# EAGLE design display (EAGLE 5.10)
2: SPI_D; 3: SPI_CLK; 4: SPI_DC; 5: SPI_CS; 6: GND; 7: 5V; 8: SPI_RES
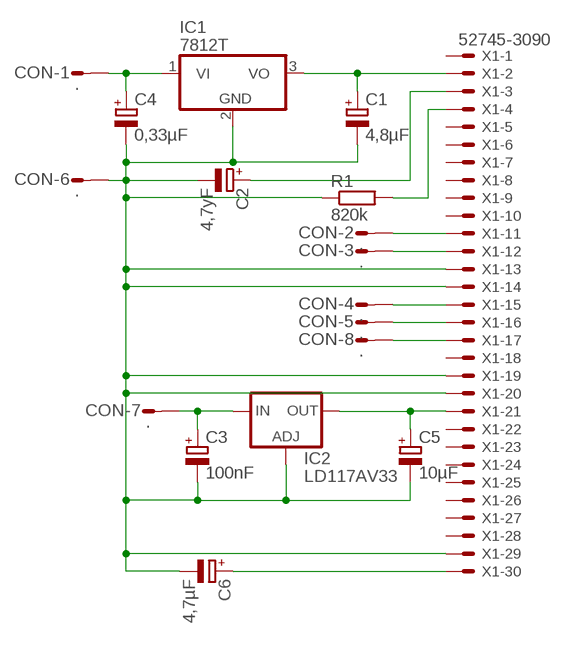
[diagram p0: schematic, sheet 1]

## Parts
C1  4,8µF  CPOL-EUE2-5  [E2-5]
C2  4,7yF  CPOL-EUE2-5  [E2-5]
C3  100nF  CPOL-EUE2-5  [E2-5]
C4  0,33µF  CPOL-EUE2-5  [E2-5]
C5  10µF  CPOL-EUE2-5  [E2-5]
C6  4,7µF  CPOL-EUE2-5  [E2-5]
CON  .  S08P  [S08P]
IC1  7812T  [TO220H]
IC2  LD117AV33  [TO220L1]
R1  820k  R-EU_0207/10  [0207/10]
X1  52745-3090  [52745-3090]

## Nets
N$1: C1.+ IC1.3(VO) X1.2
N$2: C2.+ X1.3
N$3: R1.2 X1.4
N$4: CON.4 X1.15
N$5: CON.5 X1.16
N$6: CON.2 X1.11
N$7: CON.3 X1.12
N$8: C1.- C2.- C3.- C4.- C5.- C6.- CON.6 IC1.2(GND) IC2.1(ADJ) R1.1 X1.13 X1.14 X1.19 X1.20 X1.29
N$9: CON.8 X1.17
N$10: C5.+ IC2.2(OUT) X1.21
N$11: C3.+ CON.7 IC2.3(IN)
N$12: C4.+ CON.1 IC1.1(VI)
N$15: C6.+ X1.30
Unconnected: X1.1 X1.5 X1.6 X1.7 X1.8 X1.9 X1.10 X1.18 X1.22 X1.23 X1.24 X1.25 X1.26 X1.27 X1.28

## Library data of the parts
C1-C6 = resistor:CPOL-EU: POLARIZED CAPACITOR, European symbol
CON = con-amp-mt:S08P: AMP MT CONNECTOR
IC1 = linear:78*: Positive VOLTAGE REGULATOR Source: http://cache.national.com/ds/LM/LM78L05.pdf http://www.fairchildsemi.com/ds/LM/LM7805.pdf
IC2 = v-reg:LD117A?*: Low drop fixed and adjustable positive voltage regulators 1 A Source: http://www.st.com/stonline/products/literature/ds/7194/ld1117axx.pdf
R1 = resistor:R-EU_: RESISTOR, European symbol
X1 = con-molex:52745-3090: FFC/FPC-to-Board 0.50mm (.020") SMT Top Contact Right Angle, ZIF, Style Receptacle 52745 / 52435 Source: http://www.molex.com/product/ffc/52745.html

## Board
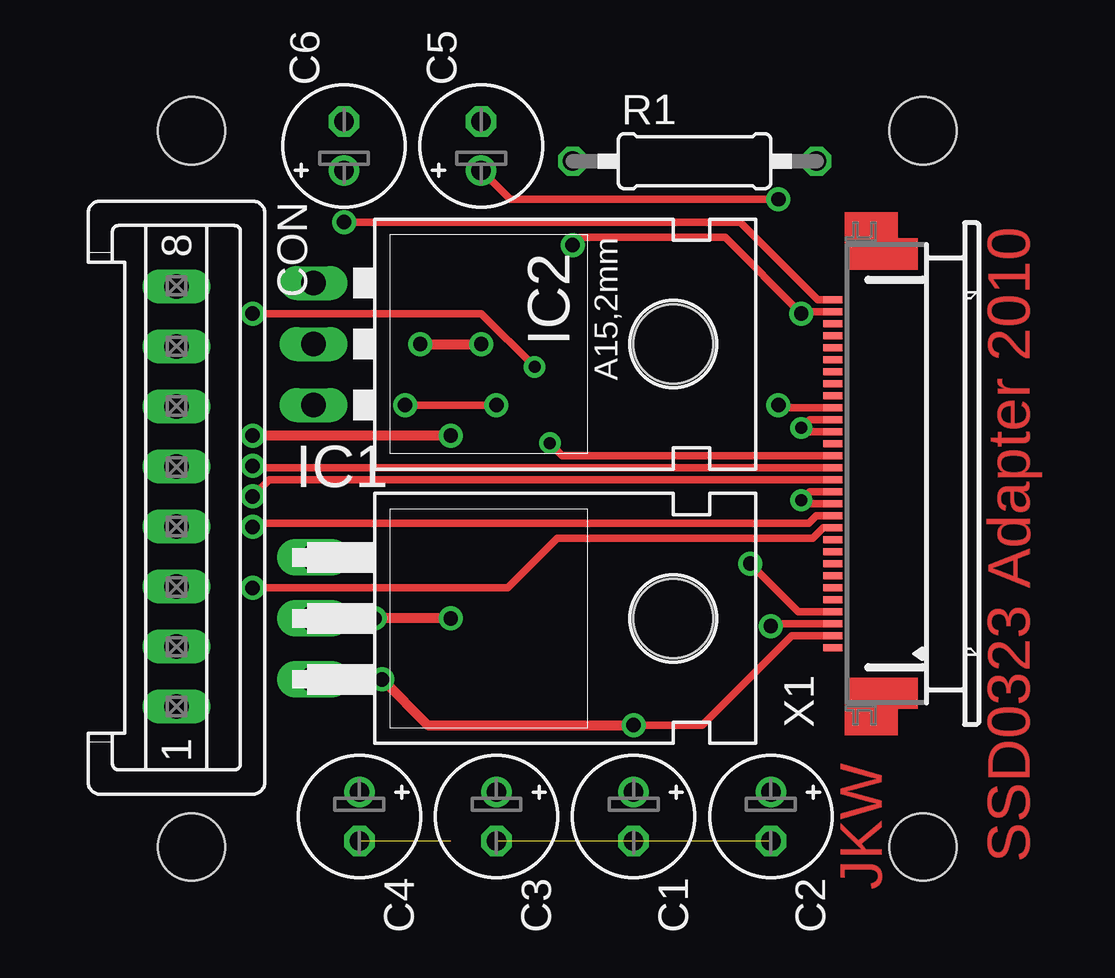
[diagram p1: board, top side]
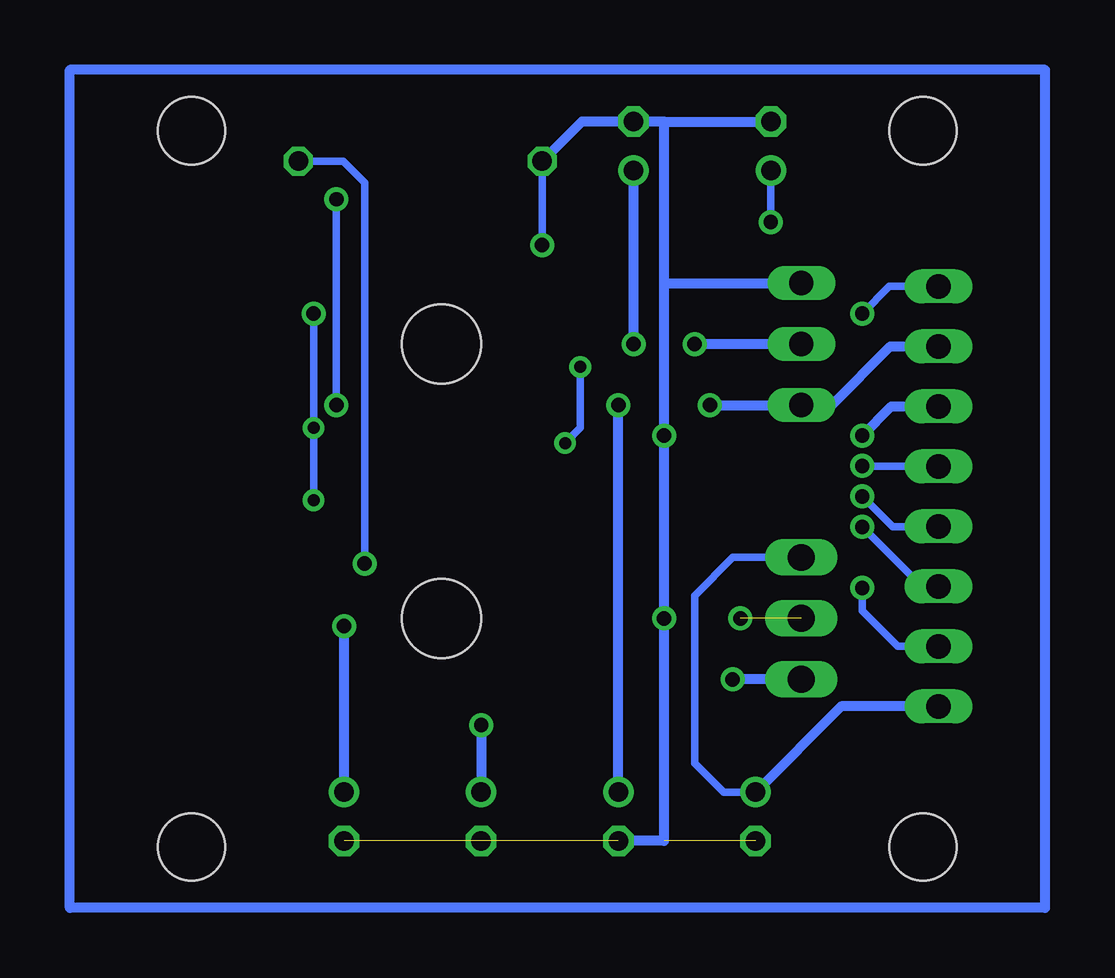
[diagram p2: board, bottom side, seen from below]

No outline drawn. Coordinates in mm, seen from the top.
Copper layers (1*16): Top 0.035mm / dielectric 1.5mm / Bottom 0.035mm
Design rules "ZWILLING *": minimum track width 0.2mm, minimum drill 0.5mm, track to track 0.195mm, track to pad 0.195mm, pad to pad 0.15mm, via to via 0.2mm, smd to smd 0mil, copper to edge 0.2mm, drill to drill 0.2mm, minimum pad ring 0.2mm, minimum via ring 0.2mm, stop-mask expansion 0.1mm, vias tented up to drill 0mil, thermal gap 10mil
Holes 2.8 mm at 13.97,39.37 44.45,39.37 44.45,9.53 13.97,9.53

### Footprints (pad centres in the part's own frame; a part is rotated, then mirrored left to right if it is on the bottom)
E2-5 = drill 0.813 pad 1.27 round: + -1.016,0 | drill 0.813 pad 1.27 octagon: - 1.016,0
S08P = drill 1.016 long: 1 8.75,0; 2 6.25,0; 3 3.75,0; 4 1.25,0; 5 -1.25,0; 6 -3.75,0; 7 -6.25,0; 8 -8.75,0
TO220H = drill 1.118 long: 1 -2.54,-10.16; 2 0,-10.16; 3 2.54,-10.16 | hole 3.302: 0,4.826
TO220L1 = drill 1.016 long: 1 -2.54,-3.81; 2 0,-3.81; 3 2.54,-3.81 | hole 3.302: 0,11.176
0207/10 = drill 0.813 octagon: 1 -5.08,0; 2 5.08,0
52745-3090 = smd 0.3 x 0.8: 1 -7.25,2.5; 2 -6.75,2.5; 3 -6.25,2.5; 4 -5.75,2.5; 5 -5.25,2.5; 6 -4.75,2.5; 7 -4.25,2.5; 8 -3.75,2.5; 9 -3.25,2.5; 10 -2.75,2.5; 11 -2.25,2.5; 12 -1.75,2.5; 13 -1.25,2.5; 14 -0.75,2.5; 15 -0.25,2.5; 16 0.25,2.5; 17 0.75,2.5; 18 1.25,2.5; 19 1.75,2.5; 20 2.25,2.5; 21 2.75,2.5; 22 3.25,2.5; 23 3.75,2.5; 24 4.25,2.5; 25 4.75,2.5; 26 5.25,2.5; 27 5.75,2.5; 28 6.25,2.5; 29 6.75,2.5; 30 7.25,2.5

### Placement (x,y rotation side)
C1  32.38,10.79 270 top
C2  38.1,10.79 270 top
C3  26.67,10.79 270 top
C4  20.95,10.79 270 top
C5  26.04,38.73 90 top
C6  20.32,38.73 90 top
CON  13.34,24.13 270 top
IC1  29.21,19.05 270 top
IC2  22.86,30.48 270 top
R1  34.92,38.1 0 top
X1  43.18,25.08 90 top

### Tracks (layer width: path | path; a pad name or v marks a point on that pad's centre or on a via)
N$1  (via drill 0.6)
  Top 0.305: X1.2 38.97,18.33 35.24,14.61 v32.38,14.61
  Top 0.406: v21.91,16.51 23.81,14.61 v32.38,14.61
  Bottom 0.406: v32.38,14.61 C1.+ | IC1.3 v21.91,16.51
N$2  (via drill 0.6)
  Top 0.305: X1.3 38.2,18.83 v38.1,18.73
  Bottom 0.406: C2.+ v38.1,18.73
N$3  (via drill 0.6)
  Top 0.305: X1.4 39.24,19.33 v37.24,21.33
  Bottom 0.305: v37.24,21.33 37.24,37.2 38.14,38.1 R1.2
N$4  (via drill 0.6)
  Top 0.305: X1.15 17.21,24.83 v16.51,24.13
  Bottom 0.2: CON.4 13.97,22.86
  Bottom 0.305: 13.36,22.86 13.97,22.86 15.24,22.86 v16.51,24.13
N$5  (via drill 0.6)
  Top 0.305: X1.16 16.58,25.33 v16.51,25.4
  Bottom 0.305: CON.5 16.49,25.38 v16.51,25.4
N$6  (via drill 0.6)
  Top 0.305: v16.51,20.32 27.15,20.32 29.21,22.38 39.85,22.38 40.3,22.83 X1.11
  Bottom 0.305: CON.2 15.02,17.88 16.51,19.37 v16.51,20.32
N$7  (via drill 0.6)
  Top 0.305: X1.12 40,23.33 39.85,23.18 | 39.85,23.18 | 39.85,23.18 39.69,23.02 16.67,23.02 v16.51,22.86
  Bottom 0.305: CON.3 14.03,20.38 v16.51,22.86
N$8  (via drill 0.5, 0.6)  (4 unrouted)
  Top 0.305: X1.19 39.52,26.83 v39.37,26.99 39.72,27.33 X1.20 | 39.45,31.83 X1.29 | 39.45,31.83 v39.37,31.75 36.2,34.92 30.16,34.92 v29.84,34.61 | 39.45,31.83 39.29,31.83 | X1.14 39.73,24.33 v39.37,23.97 39.51,23.83 X1.13
  Top 0.406: v24.77,19.05 v21.59,19.05 | v24.77,26.67 v16.51,26.67
  Bottom 0.305: R1.1 v29.84,34.61 | v39.37,31.75 v39.37,26.99 v39.37,23.97
  Bottom 0.406: 24.77,33.02 v24.77,26.67 v24.77,19.05 24.77,9.78 C3.- | CON.6 15.3,27.88 v16.51,26.67 | 24.77,33.02 IC2.1 | 24.77,39.75 C6.- | 24.77,39.75 C5.- 28.19,39.75 R1.1 | 24.77,33.02 24.77,39.75
N$9  (via drill 0.5, 0.6)
  Top 0.305: v16.51,31.75 26.04,31.75 v28.26,29.53 | X1.17 29.41,25.83 v28.89,26.35
  Bottom 0.305: CON.8 15.38,32.88 v16.51,31.75 | v28.26,29.53 28.26,26.99 v28.89,26.35
N$10  (via drill 0.6)
  Top 0.305: X1.21 38.52,27.83 v38.42,27.94 | v38.42,36.51 27.24,36.51 C5.+
  Top 0.406: v23.5,30.48 v26.04,30.48
  Bottom 0.305: v38.42,36.51 v38.42,27.94
  Bottom 0.406: v26.04,30.48 C5.+ | IC2.2 v23.5,30.48
N$11  (via drill 0.6)
  Top 0.305: v26.67,27.94 v22.86,27.94
  Bottom 0.406: C3.+ v26.67,27.94 | CON.7 15.34,30.38 17.78,27.94 IC2.3 v22.86,27.94
N$12
  Bottom 0.305: C4.+ 22.29,11.81 23.5,13.02 23.5,20 21.91,21.59 IC1.1
  Bottom 0.406: CON.1 17.39,15.38 C4.+
N$13
  Bottom 0.406: 8.89,6.99 49.53,6.99 49.53,41.91 8.89,41.91 8.89,6.99
N$15  (via drill 0.6)
  Top 0.305: X1.30 40.06,32.33 36.83,35.56 v20.32,35.56
  Bottom 0.305: C6.+ v20.32,35.56

### Text on the board
Top: JKW | SSD0323 Adapter 2010